# Altium schematic sheet lane.SchDoc: Lane
size 420 x 297 mm; CheckedBy: E.Orzes F.Martina Csaba S. Paschalis V. S.Baron; CompanyName: CERN; DrawnBy: E.Orzes; Organization: CERN; Address1: European Organization for Nuclear Research; Address2: CH-1211 Genève 23 - Switzerland; SheetNumber: 2; SheetTotal: 7; Projet: PSLink_t1; DivGrp: EP-ESE; Designer: E.Orzes; ModifiedDate: -
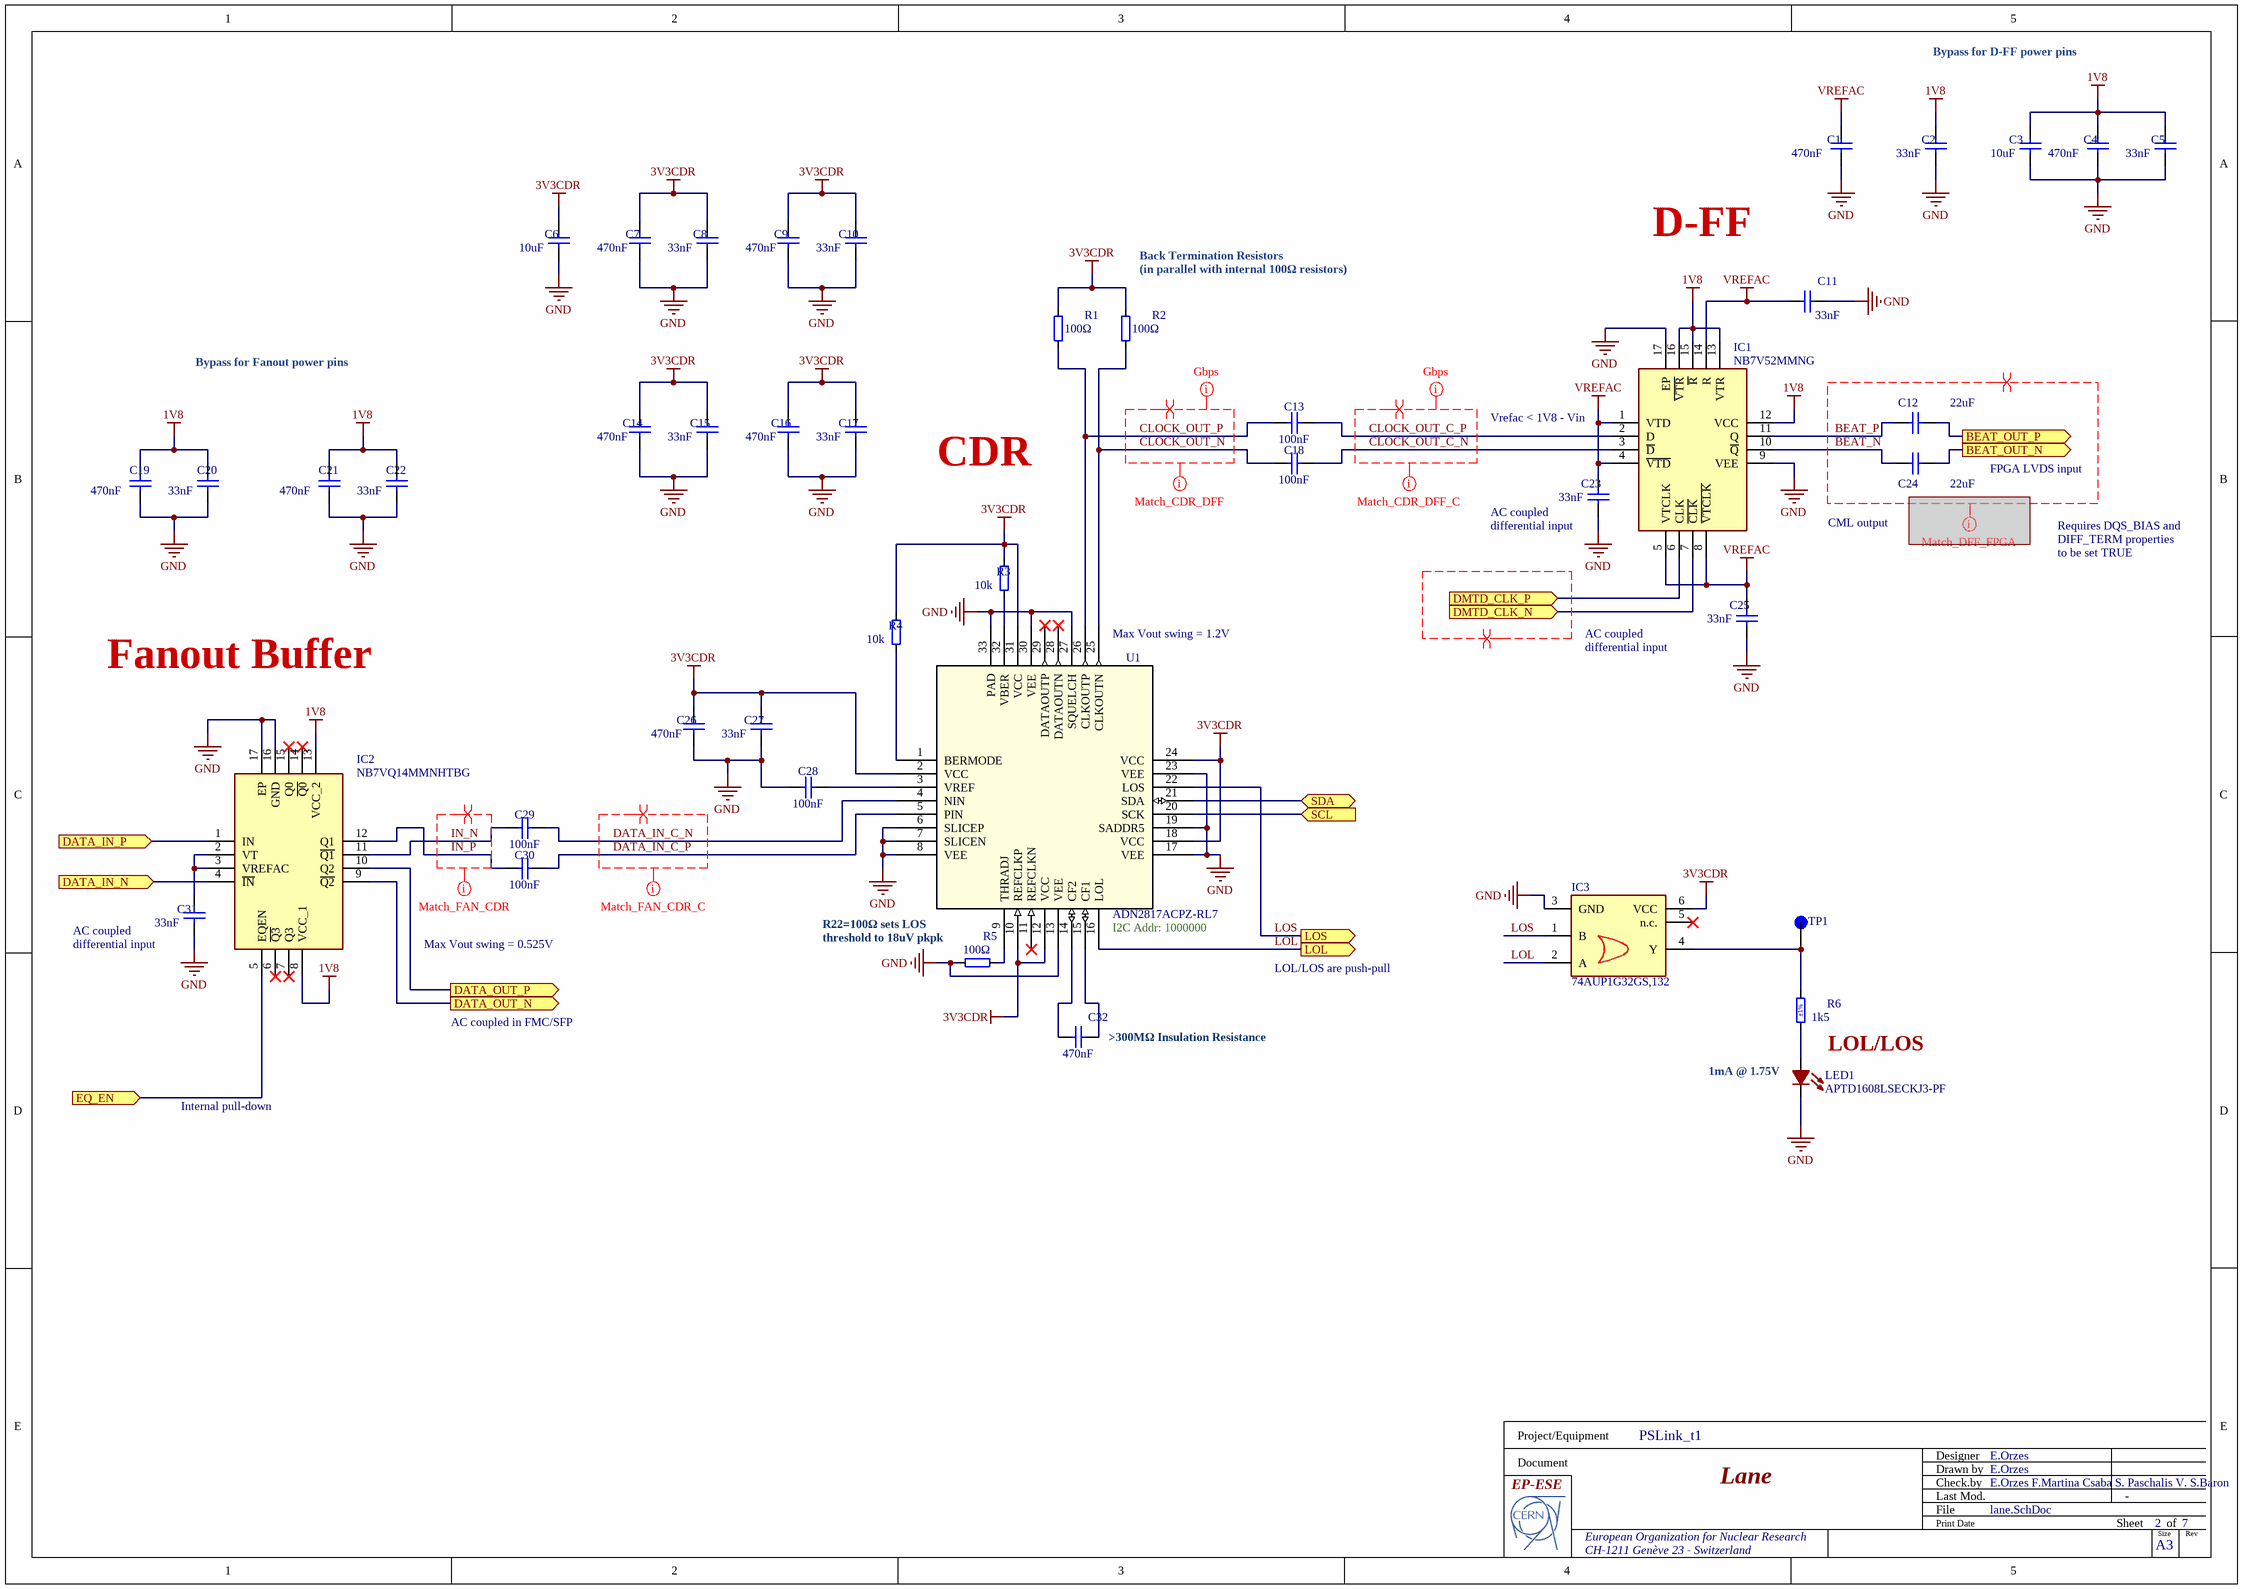
[diagram p0: lane.SchDoc]

## Parts
C1  470nF  [CAPC0510X04N]
C2  33nF  [LLL03TR61E333KE01]
C3  10uF  [CAPC1608X87N]
C4  470nF  [CAPC0510X04N]
C5  33nF  [LLL03TR61E333KE01]
C6  10uF  [CAPC1608X87N]
C7  470nF  [CAPC0510X04N]
C8  33nF  [LLL03TR61E333KE01]
C9  470nF  [CAPC0510X04N]
C10  33nF  [LLL03TR61E333KE01]
C11  33nF  [LLL03TR61E333KE01]
C12  22uF  [MURATA_HI_DENSITY_0402_CAP]
C13  100nF  [MURATA_HI_DENSITY_0201]
C14  470nF  [CAPC0510X04N]
C15  33nF  [LLL03TR61E333KE01]
C16  470nF  [CAPC0510X04N]
C17  33nF  [LLL03TR61E333KE01]
C18  100nF  [MURATA_HI_DENSITY_0201]
C19  470nF  [CAPC0510X04N]
C20  33nF  [LLL03TR61E333KE01]
C21  470nF  [CAPC0510X04N]
C22  33nF  [LLL03TR61E333KE01]
C23  33nF  [LLL03TR61E333KE01]
C24  22uF  [MURATA_HI_DENSITY_0402_CAP]
C25  33nF  [LLL03TR61E333KE01]
C26  470nF  [CAPC0510X04N]
C27  33nF  [LLL03TR61E333KE01]
C28  100nF  [MURATA_HI_DENSITY_0201]
C29  100nF  [MURATA_HI_DENSITY_0201]
C30  100nF  [MURATA_HI_DENSITY_0201]
C31  33nF  [LLL03TR61E333KE01]
C32  470nF  [CAPC2013X140N]
IC1  NB7V52MMNG  [QFN50P300X300X100-17N]
IC2  NB7VQ14MMNHTBG  [QFN50P300X300X100-17N]
IC3  74AUP1G32GS,132  [74LVC1G3157GS132]
LED1  APTD1608LSECKJ3-PF  [LED_APTD1608LSECKJ3-PF_KNB]
R1  100Ω  [MURATA_HI_DENSITY_0201]
R2  100Ω  [MURATA_HI_DENSITY_0201]
R3  10k  [MURATA_HI_DENSITY_0201]
R4  10k  [MURATA_HI_DENSITY_0201]
R5  100Ω  [MURATA_HI_DENSITY_0201]
R6  1k5  Tolerance: ±1%  [RESC1005X40N]
TP1  RCU-0C  [TP+195X110]  (value not drawn)
U1  ADN2817ACPZ-RL7  [CP_32_11_ADI]

## Ports
BEAT_OUT_N (out), BEAT_OUT_P (out), DATA_IN_N (in), DATA_IN_P (in), DATA_OUT_N (out), DATA_OUT_P (out), DMTD_CLK_N (in), DMTD_CLK_P (in), EQ_EN (in), LOL (out), LOS (out), SCL (in), SDA (bidir)

## Nets
1V8: C2.2 C3.2 C4.2 C5.2 C19.2 C20.2 C21.2 C22.2 IC1.12(VCC) IC1.13(VTR) IC1.15(~{R}) IC1.16(~{VTR}) IC2.8(VCC_1) IC2.13(VCC_2)
3V3CDR: C6.2 C7.2 C8.2 C9.2 C10.2 C14.2 C15.2 C16.2 C17.2 C26.2 C27.2 IC3.6(VCC) R1.2 R2.2 R3.2 R4.2 U1.2(VCC) U1.10(REFCLKP) U1.12(VCC) U1.18(VCC) U1.24(VCC) U1.31(VCC)
GND: C1.1 C2.1 C3.1 C4.1 C5.1 C6.1 C7.1 C8.1 C9.1 C10.1 C11.1 C14.1 C15.1 C16.1 C17.1 C19.1 C20.1 C21.1 C22.1 C23.1 C25.1 C26.1 C27.1 C28.1 C31.1 IC1.9(VEE) IC1.17(EP) IC2.16(GND) IC2.17(EP) IC3.3(GND) LED1.1(C) R5.1 U1.6(SLICEP) U1.7(SLICEN) U1.8(VEE) U1.13(VEE) U1.17(VEE) U1.19(SADDR5) U1.23(VEE) U1.27(SQUELCH) U1.30(VEE) U1.33(PAD)
VREFAC: C1.2 C11.2 C23.2 C25.2 IC1.1(VTD) IC1.4(~{VTD}) IC1.5(VTCLK) IC1.8(~{VTCLK}) IC1.14(R)
BEAT_N: C24.2 IC1.10(~{Q})
BEAT_OUT_N: C24.1 ; port BEAT_OUT_N
BEAT_OUT_P: C12.1 ; port BEAT_OUT_P
BEAT_P: C12.2 IC1.11(Q)
CLOCK_OUT_C_N: C18.2 IC1.3(~{D})
CLOCK_OUT_C_P: C13.2 IC1.2(D)
CLOCK_OUT_N: C18.1 R2.1 U1.25(CLKOUTN)
CLOCK_OUT_P: C13.1 R1.1 U1.26(CLKOUTP)
DATA_IN_C_N: C29.2 U1.4(NIN)
DATA_IN_C_P: C30.2 U1.5(PIN)
DATA_IN_N: IC2.4(~{IN}) ; port DATA_IN_N
DATA_IN_P: IC2.1(IN) ; port DATA_IN_P
DATA_OUT_N: IC2.9(~{Q2}) ; port DATA_OUT_N
DATA_OUT_P: IC2.10(Q2) ; port DATA_OUT_P
DMTD_CLK_N: IC1.7(~{CLK}) ; port DMTD_CLK_N
DMTD_CLK_P: IC1.6(CLK) ; port DMTD_CLK_P
EQ_EN: IC2.5(EQEN) ; port EQ_EN
IN_N: C29.1 IC2.11(~{Q1})
IN_P: C30.1 IC2.12(Q1)
LOL: IC3.2(A) U1.16(LOL) ; port LOL
LOS: IC3.1(B) U1.22(LOS) ; port LOS
SCL: U1.20(SCK) ; port SCL
SDA: U1.21(SDA) ; port SDA
NetC28_2: C28.2 U1.3(VREF)
NetC31_2: C31.2 IC2.2(VT) IC2.3(VREFAC)
NetC32_1: C32.1 U1.14(CF2)
NetC32_2: C32.2 U1.15(CF1)
NetIC3_4: IC3.4(Y) R6.2 TP1.1(TP)
NetLED1_2: LED1.2(A) R6.1
NetR3_1: R3.1 U1.32(VBER)
NetR4_1: R4.1 U1.1(BERMODE)
NetR5_2: R5.2 U1.9(THRADJ)

Not connected (* = marked no-connect by the designer): IC2 6(~{Q3})* 7(Q3)* 14(~{Q0})* 15(Q0)*; IC3 5(n.c.)*; U1 11(REFCLKN)* 28(DATAOUTN)* 29(DATAOUTP)*

## Layout directives
differential pair: (no net found under the mark), BEAT_N, BEAT_P, CLOCK_OUT_C_N, CLOCK_OUT_C_P, CLOCK_OUT_N, CLOCK_OUT_P, DATA_IN_C_N, DATA_IN_C_P, IN_N, IN_P
net class Match_DFF_FPGA: BEAT_N, BEAT_P
mark named Gbps: CLOCK_OUT_C_N, CLOCK_OUT_C_P, CLOCK_OUT_N, CLOCK_OUT_P
net class Match_CDR_DFF: CLOCK_OUT_N, CLOCK_OUT_P
net class Match_FAN_CDR_C: DATA_IN_C_N, DATA_IN_C_P
net class Match_FAN_CDR: IN_N, IN_P
net class Match_CDR_DFF_C: CLOCK_OUT_C_N, CLOCK_OUT_C_P

## Notes on the sheet
- Bypass for D-FF power pins
- D-FF
- (near R2) Back Termination Resistors
  (in parallel with internal 100Ω resistors)
- Bypass for Fanout power pins
- Vrefac < 1V8 - Vin swing/2
- CDR
- (near C23) AC coupled
  differential input
- CML output
- FPGA LVDS input
- Requires DQS_BIAS and DIFF_TERM properties to be set TRUE
- (near U1) Max Vout swing = 1.2V
- AC coupled
  differential input
- Fanout Buffer
- (near U1) R22=100Ω sets LOS threshold to 18uV pkpk
- (near U1) I2C Addr: 1000000
- (near C31) AC coupled
  differential input
- Max Vout swing = 0.525V
- LOL/LOS are push-pull
- AC coupled in FMC/SFP
- (near C32) >300MΩ Insulation Resistance
- (near LED1) 1mA @ 1.75V
- LOL/LOS
- Internal pull-down
- Project/Equipment
- Document
- Designer
- Drawn by
- Check.by
- File
- Last Mod.
- Print Date
- Sheet
- Size
- A3
- of
- Rev

## Library data of the parts
C1 C4 C7 C9 C14 C16 C19 C21 C26 = Capacitor - non polarized: LLL153C70G474ME17; Value: 470nF
C2 C5 C8 C10 C11 C15 C17 C20 C22 C23 C25 C27 C31 = Capacitor - non polarized: LLL03TR61E333KE01; Value: 33nF
C3 C6 = CC0603_10UF_6.3V_20%_X5R: C1608X5R1E106M080AC; Part Description: SMD Multilayer Chip Ceramic Capacitor; Manufacturer: GENERIC; Manufacturer1 Part Number: C0603C106M9PAC; Voltage: 6.3V; TC: X5R; Tolerance: ±20%; Part Number: CC0603_10UF_6.3V_20%_X5R; Component Kind: Standard; Component Type: Standard; Pin Count: 2; Value: 10uF; Status: Preferred; Manufacturer Part Number: CC0603_10uF_6.3V_20%_X5R; Case: 0603; Mounted: Yes; Socket: No; SMD: Yes; Sense: No; Manufacturer1 Example: KEMET; Manufacturer1 ComponentHeight: 0.95mm; HelpURL: \\cern.ch\dfs\Applications\Altium\Datasheets\CC0603_X5R_KEMET.pdf; Author: CERN DEM JLC; CreateDate: 03/12/2007; LatestRevisionDate: 03/12/2007
C12 C24 = C0402-22uF-high-density: GRM155R60J226ME11; Vmax: 6.3V; Value: 22uF
C13 C18 C28-C30 = C0201-100nF-high-density: GRM033R61C104KE14; Vmax: 16V; Value: 100nF
C32 = CC0805_470NF_50V_10%_X7R_MURATA_GCM21BR71H474KA55L: GCM21BR71H474KA55L; Part Description: SMD Chip Monolithic Ceramic Capacitor for Automotive; Manufacturer: MURATA; Voltage: 50V; TC: X7R; Tolerance: ±10%; Part Number: CC0805_470NF_50V_10%_X7R_MURATA_GCM21BR71H474KA55L; Component Kind: Standard; Component Type: Standard; Pin Count: 2; Value: 470nF; Status: Not Recommended; Manufacturer Part Number: GCM21BR71H474KA55L; Case: 0805; Mounted: Yes; Socket: No; SMD: Yes; Sense: No; ComponentHeight: 1.4mm; HelpURL: \\cern.ch\dfs\Applications\Altium\Datasheets\CC0805_MURATA_GCM21BR71H474KA55L.pdf; Author: CERN DEM JLC; CreateDate: 5/10/2017; LatestRevisionDate: 5/10/2017
IC1 = NB7V52MMNG: Integrated Circuit; Manufacturer_Name: onsemi; Datasheet Link: https://www.onsemi.com/pdf/datasheet/nb7v52m-d.pdf; Height: 1mm; Manufacturer_Part_Number: NB7V52MMNG; Mouser Part Number: 863-NB7V52MMNG; Mouser Price/Stock: https://www.mouser.co.uk/ProductDetail/ON-Semiconductor/NB7V52MMNG?qs=N5dOQkml4H8i91m%252BmwlaUQ%3D%3D; Arrow Part Number: NB7V52MMNG; Arrow Price/Stock: https://www.arrow.com/en/products/nb7v52mmng/on-semiconductor
IC2 = NB7VQ14MMNHTBG: Integrated Circuit; Manufacturer_Name: onsemi; Datasheet Link: http://www.onsemi.com/pub/Collateral/NB7VQ14M-D.PDF; Height: 1mm; Manufacturer_Part_Number: NB7VQ14MMNHTBG; Mouser Part Number: 863-NB7VQ14MMNHTBG; Mouser Price/Stock: https://www.mouser.co.uk/ProductDetail/onsemi/NB7VQ14MMNHTBG?qs=3PKVEWFFm2%2FWq%2FFZ4xstfg%3D%3D; Arrow Part Number: NB7VQ14MMNHTBG; Arrow Price/Stock: https://www.arrow.com/en/products/nb7vq14mmnhtbg/on-semiconductor?utm_currency=USD&region=nac
IC3 = 74AUP1G32GS,132: Integrated Circuit; Manufacturer_Name: Nexperia; Datasheet Link: https://assets.nexperia.com/documents/data-sheet/74AUP1G32.pdf; Height: 0.35mm; Manufacturer_Part_Number: 74AUP1G32GS,132; Mouser Part Number: 771-74AUP1G32GS132; Mouser Price/Stock: https://www.mouser.com/Search/Refine.aspx?Keyword=771-74AUP1G32GS132
LED1 = APTD1608LSECKJ3-PF: Led Red 0603 2mA 1.8V 50mcd 84mW; Mfr_Name: Kingbright
R1 R2 R5 = R0201-100ohm-high-density: Resistor; Value: 100Ω
R3 R4 = R0201-100ohm-high-density: Resistor 10k; Value: 100Ω
R6 = R0402_1K5_1%_0.0625W_100PPM: Resistor - 1%; Part Description: General Purpose Thick Film Chip Resistor; Manufacturer: GENERIC; Manufacturer1 Part Number: 232270671502L; TC: ±100ppm/°C; PressFit: No; Part Number: R0402_1K5_1%_0.0625W_100PPM; Component Kind: Standard; Component Type: Standard; Pin Count: 2; Value: 1k5; Status: Not Recommended; Power: 0.0625W; Manufacturer Part Number: R0402_1K5_1%_0.0625W_100PPM; Case: 0402; Mounted: Yes; Sense: No; Socket: No; SMD: Yes; Manufacturer1 Example: YAGEO PHYCOMP; Manufacturer1 ComponentHeight: 0.4mm; HelpURL: \\cern.ch\dfs\Applications\Altium\Datasheets\R0402_Phycomp_RC0402.pdf; Author: CERN DEM JLC; CreateDate: 12/3/2007; LatestRevisionDate: 10/17/2012
TP1 = RCU-0C: MF: {'manufacturer': u'TE Connectivity AMP Connectors'}; Package: None; Price: None; Value: *; MP: RCU-0C; Availability: Unavailable
U1 = ADN2817ACPZ-RL7: CDR; Mfr_Name: Analog Devices Inc; RefDes: RefDes; Type: Type